# Altium schematic sheet ESP8266.SchDoc
size A
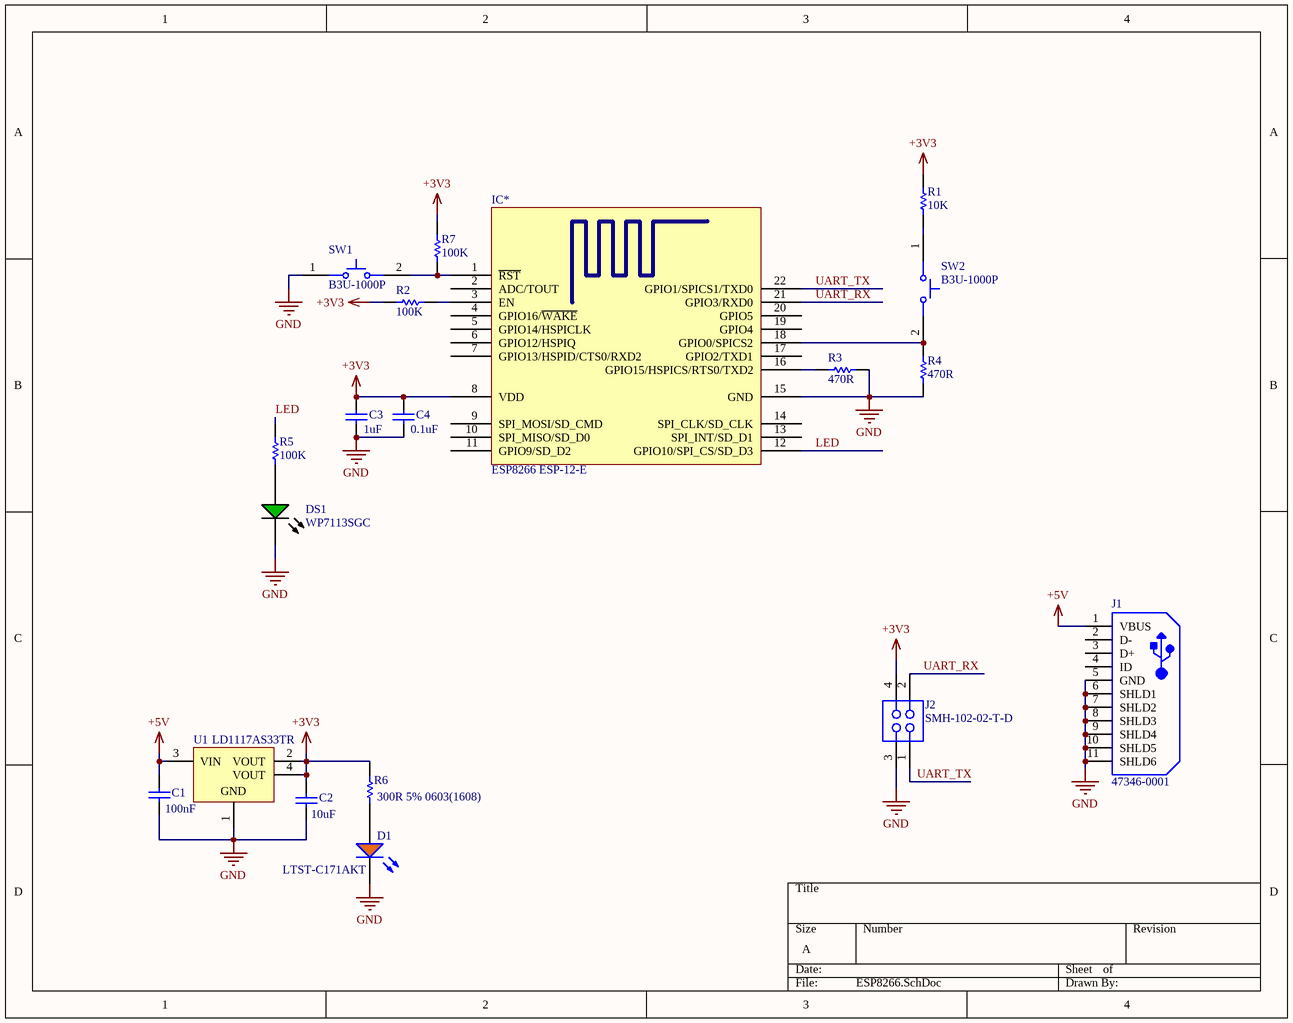
[diagram p0: ESP8266.SchDoc]

## Parts
C1  100nF  [CAPC0805(2012)145_L]
C2  10uF  [CAPC0805(2012)145_L]
C3  1uF  [CAPC0805(2012)145_L]
C4  0.1uF  [CAPC0805(2012)145_L]
D1  LTST-C171AKT  [LTST-C171AKT_V]
DS1  WP7113SGC  [KING-WP7113SGC_V]
IC*  ESP8266 ESP-12-E  [ESP8266 ESP-12-E]
J1  47346-0001  [MOLX-47346-0001-5_V]
J2  SMH-102-02-T-D  [SMTC-SMH-102-02-X-D]
R1  10K  [RESC0603(1608)_L]
R2  100K  [RESC0603(1608)_L]
R3  470R  [RESC0603(1608)_L]
R4  470R  [RESC0603(1608)_L]
R5  100K  [RESC0603(1608)_L]
R6  300R 5% 0603(1608)  [RESC0603(1608)_N]
R7  100K  [RESC0603(1608)_L]
SW1  B3U-1000P  [OMRON-B3U-1000_V]
SW2  B3U-1000P  [OMRON-B3U-1000_V]
U1  LD1117AS33TR  [SOT-223_M]

## Nets
+3V3: C2.2 C3.2 C4.2 IC*.8(VDD) J2.4 R1.1 R2.1 R6.2 R7.2 U1.2(VOUT) U1.4(VOUT)
+5V: C1.2 J1.1(VBUS) U1.3(VIN)
GND: C1.1 C2.1 C3.1 C4.1 D1.C DS1.2(K) IC*.15(GND) J1.5(GND) J1.6(SHLD1) J1.7(SHLD2) J1.8(SHLD3) J1.9(SHLD4) J1.10(SHLD5) J1.11(SHLD6) J2.3 R3.1 R4.1 SW1.1 U1.1(GND)
LED: IC*.12(GPIO10/SPI_CS/SD_D3) R5.2
UART_RX: IC*.21(GPIO3/RXD0) J2.2
UART_TX: IC*.22(GPIO1/SPICS1/TXD0) J2.1
NetD1_A: D1.A R6.1
NetDS1_1: DS1.1(A) R5.1
NetIC*_1: IC*.1(~{RST}) R7.1 SW1.2
NetIC*_3: IC*.3(EN) R2.2
NetIC*_16: IC*.16(GPIO15/HSPICS/RTS0/TXD2) R3.2
NetIC*_18: IC*.18(GPIO0/SPICS2) R4.2 SW2.2
NetR1_2: R1.2 SW2.1

Not connected (* = marked no-connect by the designer): IC* 2(ADC/TOUT) 4(GPIO16/~{WAKE}) 5(GPIO14/HSPICLK) 6(GPIO12/HSPIQ) 7(GPIO13/HSPID/CTS0/RXD2) 9(SPI_MOSI/SD_CMD) 10(SPI_MISO/SD_D0) 11(GPIO9/SD_D2) 13(SPI_INT/SD_D1) 14(SPI_CLK/SD_CLK) 17(GPIO2/TXD1) 19(GPIO4) 20(GPIO5); J1 2(D-) 3(D+) 4(ID)

## Library data of the parts
C1-C4 = CMP-1590-00003-1: 0805 (2012 Metric) Chip Capacitor; Case-EIA: 0805; Case-Metric: 2012; PackageReference: CAPC0805(2012)145
  C1: Value: 100nF
  C2: Value: 10uF
  C3: Value: 1uF
  C4: Value: 0.1uF
D1 = CMP-1674-00004-3: LED AMBER CLR THIN 0805 SMD; Manufacturer: Lite-On; PartNumber: LTST-C171AKT; ComponentLink1URL: http://optoelectronics.liteon.com/upload/download/DS-22-99-0170/S_110_LTST-C171AKT.pdf; PackageReference: C171AKT; ComponentLink1Description: Datasheet
DS1 = CMP-1757-00001-1: The Super Bright Green Source Color Device, 2.2 V, -40 to 85 degC, 2-Pin THD, RoHS, Tape and Reel; Viewing Angle: 170 degrees; Lens Style: Diffused; Luminous Intensity: 8 mcd; Illumination Colour: Yellow; Forward Voltage: 2.1 V; Case\Package: 0603; Nominal Wavelength: 586 nm; Power Rating: 52 mW; Forward Current: 20 mA; Case Code (Imperial): 0603; Packaging: Tape and Reel; Case Code (Metric): 1608; Length: 1.6 mm; Mount: Surface Mount; DatasheetVersion: Rev. 9B, 01/2015; RoHSCompliant: true; ComponentLink1URL: http://www.kingbrightusa.com/images/catalog/SPEC/WP7113SGC.pdf; Colour: Yellow; Width: 0.8 mm; Min Operating Temperature: -40 degC; Pins: 2; PackageReference: WP7113SGC; Package Quantity: 4000; PackageDescription: 2-Pin Through Hole Device, Dia 5.9 mm, Body Length 8.6 mm; Radiation Hardening: No; ComponentLink1Description: Datasheet; Height: 0.8 mm; Max Operating Temperature: 85 degC; Nominal Vf: 2.1 V
J1 = CMP-2000-05246-1: Micro-USB B Receptacle with Flange, -30 to 85 degC, 5-Pin SMD, RoHS, Tape and Reel; Manufacturer: Molex; Number of Contacts: 5; Body Orientation: RightAngle; Maximum Voltage Rating: 30VAC; Pitch: 0.65mm; Maximum Current Rating: 1.8/ContactA; Number of Ports: 1; Gender: RCP; Operating Temperature: -30to85C; Part No: 47346-0001; Color: Black; Termination Method: Solder; Contact Plating: GoldOverPalladiumNickelOverNickel; Dimension: 7.8x5.43x2.94mm; Number of Terminals: 5; Datasheet Version: Dec-13; Datasheet URL: https://datasheet.ciiva.com/30075/304740473460001-io-nectors-30075527.pdf; Contact Material: CopperAlloy; RoHS: Yes; Housing Material: LiquidCrystalPolymer; Manufacturer URL: http://www.molex.com/; Packaging: EmbossedTapeandReel; Mounting: SurfaceMount; Type: MicroUSBTypeB
J2 = CMP-1023-00148-1: SMT Horizontal Socket, -55 to 105 degC, 2.54 mm Pitch, 4-Pin, Female, RoHS; Manufacturer: Samtec; Pitch: 2.54 mm; PackageDescription: .100 [2.54] Horizontal SMT Socket Assembly; ComponentLink1URL: http://www.samtec.com; PackageVersion: AF, 2/1999; ComponentLink3URL: http://www.samtec.com/documents/webfiles/cpdf/SMH-1XX-XX-XX-X-XX-MKT.pdf; RoHS: True; Orientation: Horizontal; PartNumber: SMH-102-02-T-D; DatasheetVersion: F-214; ComponentLink3Description: Package Specification; PackageReference: SMH-102-02-X-D; Mounting Technology: Surface Mount; ComponentLink1Description: Manufacturer URL; ComponentLink2URL: http://www.samtec.com/documents/webfiles/pdf/SMH.PDF; Temperature Range: -55 to 105 degC; ComponentLink2Description: Datasheet
R1-R5 R7 = CMP-1591-00001-1: 0603 (1608 Metric) Chip Resistor; Case-Metric: 1608; Case-EIA: 0603; PackageReference: RESC0603(1608)
R6 = CMP-1012-00122-1: 100K 0.1W 5% 0603 (1608 Metric)  SMD; Case-EIA: 0603; Value: 100000.00 Ohm; Case-Metric: 1608; Tolerance: 5 %; Power: 0.1 W; Technology: SMT
SW1 SW2 = CMP-2100-03586-1: Ultra-Small Tactile Switch, 0.05 A, 12 V, -25 to 70 degC, 2-Pin SMD, RoHS, Tape and Reel; Manufacturer: Omron Electronic Components; Operating Force: 1.5N; Current Rating: 50mA; Voltage Rating (DC): 12V; Electrical Life: 200000Cycles; Actuator Length: 0.4mm; Insulation Resistance: 100MOhm; Switch Travel: 0.15mm; Throw Configuration: SPST; Illumination Type: Illuminated; Width: 3mm; Weight: 0.022g; Datasheet Version: 42005.0; Datasheet URL: http://www.omron.com/ecb/products/pdf/en-b3u.pdf; Height: 1.2mm; Package Quantity: 1; REACH SVHC: Unknown; Contact Current Rating: 50mA; Contact Material: Silver; Max Current Rating: 50mA; Package Reference: B3U-1000; Termination: SMD/SMT; Packaging: TapeandReel; Manufacturer URL: http://www.omron.com/; RoHSCompliant: true; Mount: SurfaceMount; Length: 4mm; Min Operating Temperature: -25degC; Depth: 2.5mm; Lead Free: LeadFree; Case/Package: SMD/SMT; Package Description: 2-Pin Surface Mount Device, Body 3 x 2.5 mm; Max Operating Temperature: 70degC; Orientation: Straight
U1 = CMP-0244-00316-1: 1A, Low Drop Positive Voltage Regulator, 3.3V, 4-Pin SOT-223, Tape and Reel; ComponentLink1Description: Manufacturer URL; DatasheetVersion: 2/12/2011; PackageVersion: 2010; ComponentLink1URL: http://www.st.com; ComponentLink2Description: Datasheet; ComponentLink2URL: http://www.st.com/internet/com/TECHNICAL_RESOURCES/TECHNICAL_LITERATURE/DATASHEET/CD00002116.pdf; PackageDescription: 4-Pin SOT-223 Package, 6.5 x 3.5 mm Body, 2.3 mm Pitch, 7 mm Lead Span; PackageReference: SOT-223